# Altium schematic sheet LEDs.SchDoc
size A; SheetNumber: 6; SheetTotal: 9
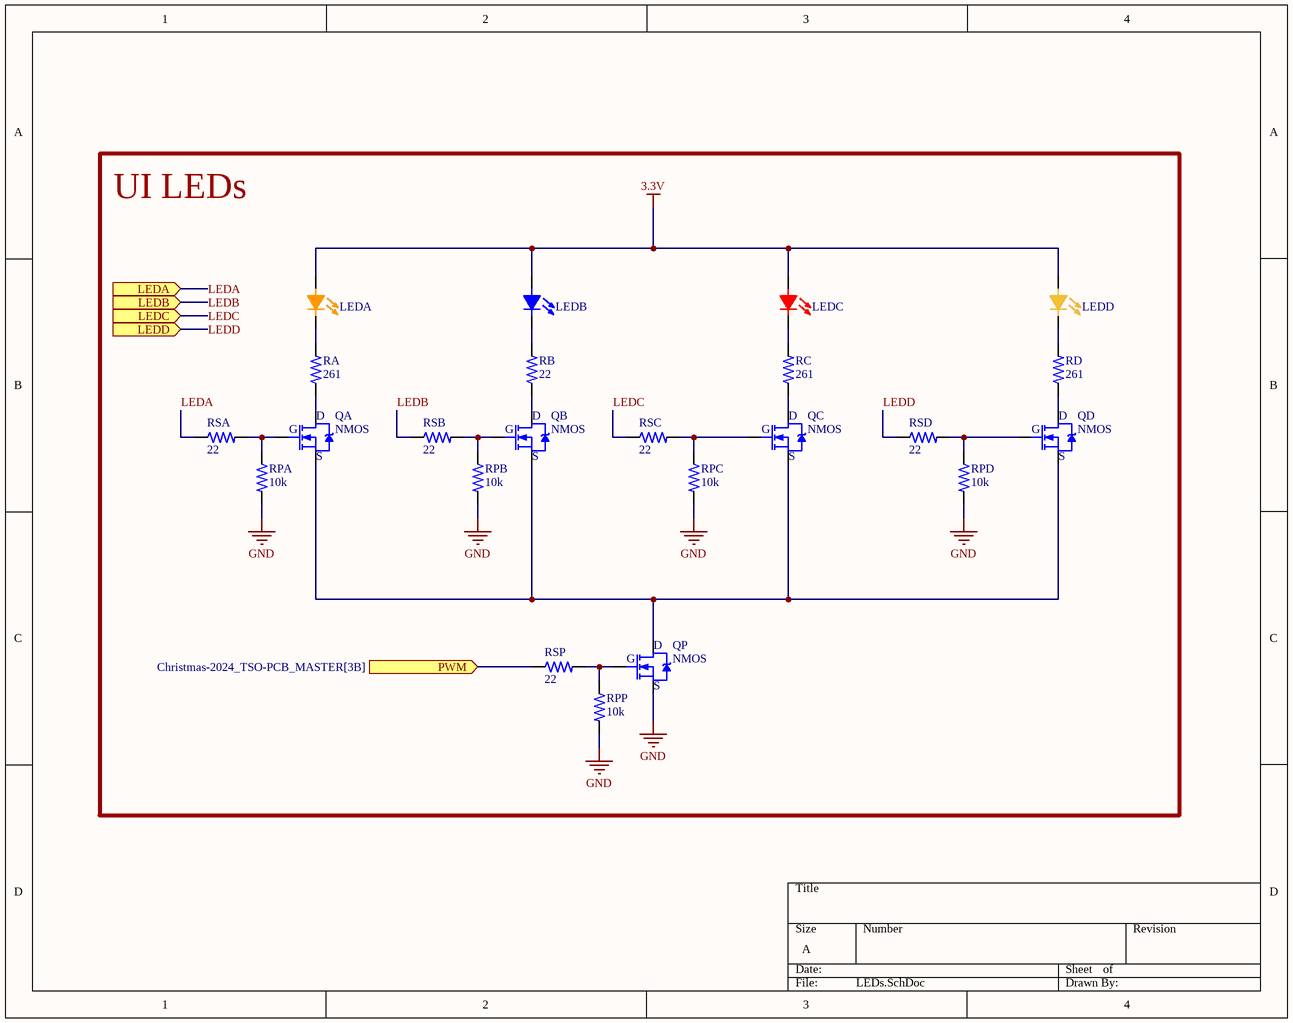
[diagram p0: LEDs.SchDoc]

## Parts
LEDA  LED - ORANGE  [LED - 0603 - ORANGE]  (value not drawn)
LEDB  LED - BLUE  [LED - 0603 - BLUE]  (value not drawn)
LEDC  LED - RED  [LED - 0603 - RED]  (value not drawn)
LEDD  LED - YELLOW  [LED - 0603]  (value not drawn)
QA  NMOS  [SOT-23]
QB  NMOS  [SOT-23]
QC  NMOS  [SOT-23]
QD  NMOS  [SOT-23]
QP  NMOS  [SOT-23]
RA  value 261  [0402R]  (hidden comment: RES)
RB  value 22  [0402R]  (hidden comment: RES)
RC  value 261  [0402R]  (hidden comment: RES)
RD  value 261  [0402R]  (hidden comment: RES)
RPA  value 10k  [0402R]  (hidden comment: RES)
RPB  value 10k  [0402R]  (hidden comment: RES)
RPC  value 10k  [0402R]  (hidden comment: RES)
RPD  value 10k  [0402R]  (hidden comment: RES)
RPP  value 10k  [0402R]  (hidden comment: RES)
RSA  value 22  [0402R]  (hidden comment: RES)
RSB  value 22  [0402R]  (hidden comment: RES)
RSC  value 22  [0402R]  (hidden comment: RES)
RSD  value 22  [0402R]  (hidden comment: RES)
RSP  value 22  [0402R]  (hidden comment: RES)

## Blocks framed on the sheet
UI LEDs: LEDA LEDB LEDC LEDD QA QB QC QD QP RA RB RC RD RPA RPB RPC RPD RPP RSA RSB RSC RSD RSP

## Ports
LEDA (in, see Christmas-2024_TSO-PCB_MASTER[3B]), LEDB (in, see Christmas-2024_TSO-PCB_MASTER[3B]), LEDC (in, see Christmas-2024_TSO-PCB_MASTER[3B]), LEDD (in, see Christmas-2024_TSO-PCB_MASTER[3B]), PWM (in, see Christmas-2024_TSO-PCB_MASTER[3B])

## Nets
3.3V: LEDA.1(A) LEDB.1(A) LEDC.1(A) LEDD.1(A)
GND: QP.2(S) RPA.2 RPB.2 RPC.2 RPD.2 RPP.2
LEDA: RSA.1 ; port LEDA
LEDB: RSB.1 ; port LEDB
LEDC: RSC.1 ; port LEDC
LEDD: RSD.1 ; port LEDD
PWM: RSP.1 ; port PWM
NetLEDA_2: LEDA.2(C) RA.2
NetLEDB_2: LEDB.2(C) RB.2
NetLEDC_2: LEDC.2(C) RC.2
NetLEDD_2: LEDD.2(C) RD.2
NetQA_1: QA.1(G) RPA.1 RSA.2
NetQA_2: QA.2(S) QB.2(S) QC.2(S) QD.2(S) QP.3(D)
NetQA_3: QA.3(D) RA.1
NetQB_1: QB.1(G) RPB.1 RSB.2
NetQB_3: QB.3(D) RB.1
NetQC_1: QC.1(G) RPC.1 RSC.2
NetQC_3: QC.3(D) RC.1
NetQD_1: QD.1(G) RPD.1 RSD.2
NetQD_3: QD.3(D) RD.1
NetQP_1: QP.1(G) RPP.1 RSP.2

## Library data of the parts
LEDA = LED - ORANGE: LED, Orange, 0603; MFR: Lite-On Inc.; MFR PN: LTST-C190KFKT; Vf: 2V; Color: Orange; Type: SMD
LEDB = LED - BLUE: LED, Blue, 0603; MFR: Würth Elektronik; MFR PN: 150060BS75000; Vf: 3.2V; Color: Blue; Type: SMD
LEDC = LED - RED: LED, Red, 0603; MFR: Würth Elektronik; MFR PN: 150060RS75000; Vf: 2V; Color: Red; Type: SMD
LEDD = LED - YELLOW: LED, Yellow, 0603; MFR: Würth Elektronik; MFR PN: 150060YS75000; Vf: 2V; Color: Yellow; Type: SMD
QA QB QC QD QP = NMOS: N-Channel MOSFET; MFR PN: DMN63D8L-7; MFR: Diodes Incorporated; Type: SMD
RA RC RD = RES: Resistor; MFR PN: RC0402FR-07261RL; MFR: YAGEO; Type: SMD
RB RSA RSB RSC RSD RSP = RES: Resistor; MFR PN: RC0402FR-0722RL; MFR: YAGEO; Type: SMD
RPA RPB RPC RPD RPP = RES: Resistor; MFR PN: RC0402JR-0710KL; MFR: YAGEO; Type: SMD